# Altium schematic sheet Sheet_1_2026-02-10.schdoc
size 331 x 266 mm
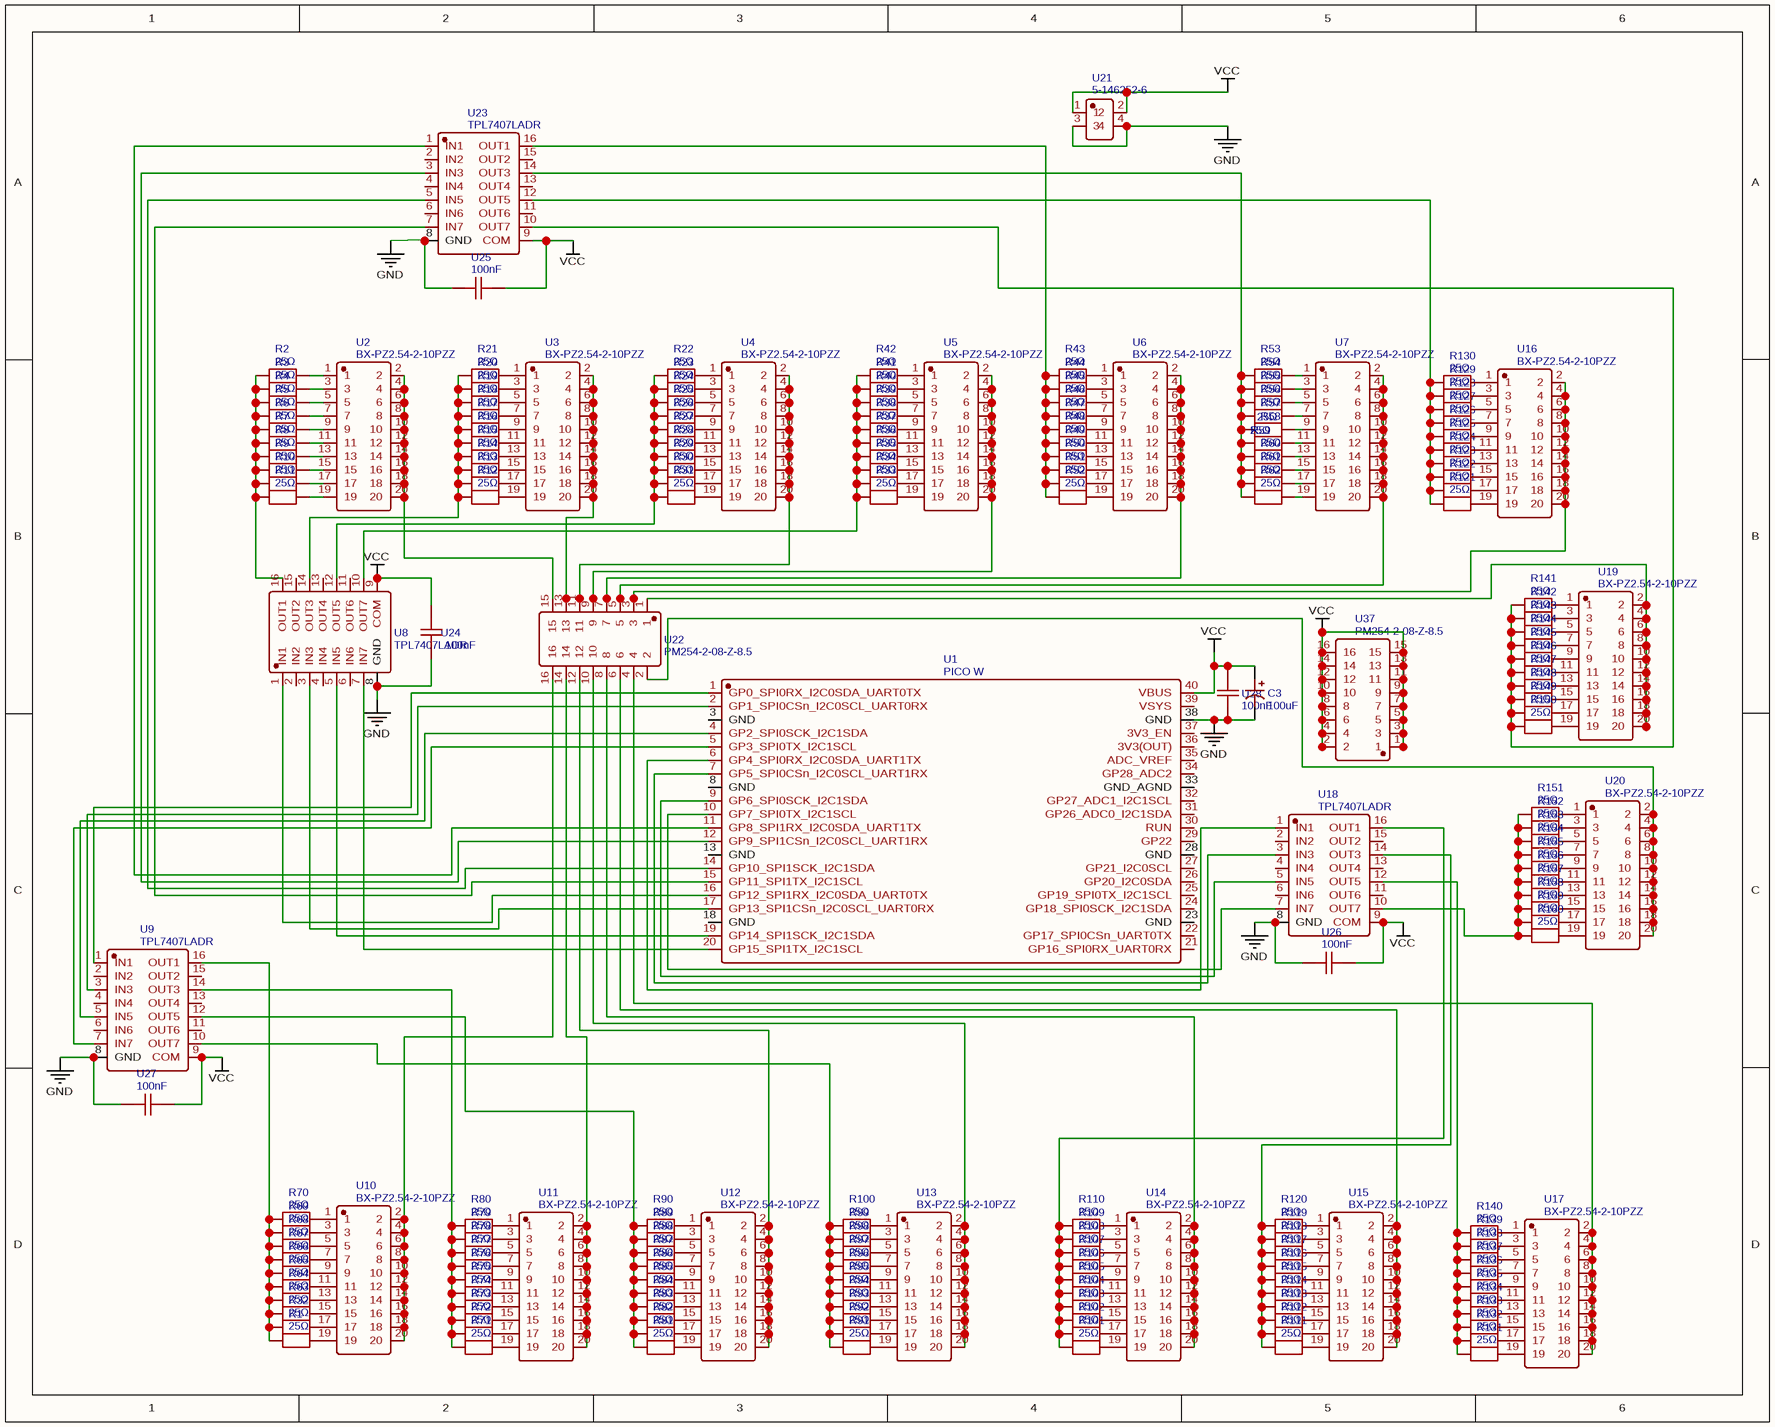
[diagram p0: Sheet_1_2026-02-10.schdoc]

## Parts
C3  100uF  [CAP-TH_BD6.3-P2.50-D0.5-FD-100UF25V6.3X11KM]
R1  25Ω  [R0805]
R2  25Ω  [R0805]
R3  25Ω  [R0805]
R4  25Ω  [R0805]
R5  25Ω  [R0805]
R6  25Ω  [R0805]
R7  25Ω  [R0805]
R8  25Ω  [R0805]
R9  25Ω  [R0805]
R10  25Ω  [R0805]
R11  25Ω  [R0805]
R12  25Ω  [R0805]
R13  25Ω  [R0805]
R14  25Ω  [R0805]
R15  25Ω  [R0805]
R16  25Ω  [R0805]
R17  25Ω  [R0805]
R18  25Ω  [R0805]
R19  25Ω  [R0805]
R20  25Ω  [R0805]
R21  25Ω  [R0805]
R22  25Ω  [R0805]
R23  25Ω  [R0805]
R24  25Ω  [R0805]
R25  25Ω  [R0805]
R26  25Ω  [R0805]
R27  25Ω  [R0805]
R28  25Ω  [R0805]
R29  25Ω  [R0805]
R30  25Ω  [R0805]
R31  25Ω  [R0805]
R32  25Ω  [R0805]
R33  25Ω  [R0805]
R34  25Ω  [R0805]
R35  25Ω  [R0805]
R36  25Ω  [R0805]
R37  25Ω  [R0805]
R38  25Ω  [R0805]
R39  25Ω  [R0805]
R40  25Ω  [R0805]
R41  25Ω  [R0805]
R42  25Ω  [R0805]
R43  25Ω  [R0805]
R44  25Ω  [R0805]
R45  25Ω  [R0805]
R46  25Ω  [R0805]
R47  25Ω  [R0805]
R48  25Ω  [R0805]
R49  25Ω  [R0805]
R50  25Ω  [R0805]
R51  25Ω  [R0805]
R52  25Ω  [R0805]
R53  25Ω  [R0805]
R54  25Ω  [R0805]
R55  25Ω  [R0805]
R56  25Ω  [R0805]
R57  25Ω  [R0805]
R58  25Ω  [R0805]
R59  25Ω  [R0805]
R60  25Ω  [R0805]
R61  25Ω  [R0805]
R62  25Ω  [R0805]
R63  25Ω  [R0805]
R64  25Ω  [R0805]
R65  25Ω  [R0805]
R66  25Ω  [R0805]
R67  25Ω  [R0805]
R68  25Ω  [R0805]
R69  25Ω  [R0805]
R70  25Ω  [R0805]
R71  25Ω  [R0805]
R72  25Ω  [R0805]
R73  25Ω  [R0805]
R74  25Ω  [R0805]
R75  25Ω  [R0805]
R76  25Ω  [R0805]
R77  25Ω  [R0805]
R78  25Ω  [R0805]
R79  25Ω  [R0805]
R80  25Ω  [R0805]
R81  25Ω  [R0805]
R82  25Ω  [R0805]
R83  25Ω  [R0805]
R84  25Ω  [R0805]
R85  25Ω  [R0805]
R86  25Ω  [R0805]
R87  25Ω  [R0805]
R88  25Ω  [R0805]
R89  25Ω  [R0805]
R90  25Ω  [R0805]
R91  25Ω  [R0805]
R92  25Ω  [R0805]
R93  25Ω  [R0805]
R94  25Ω  [R0805]
R95  25Ω  [R0805]
R96  25Ω  [R0805]
R97  25Ω  [R0805]
R98  25Ω  [R0805]
R99  25Ω  [R0805]
R100  25Ω  [R0805]
R101  25Ω  [R0805]
R102  25Ω  [R0805]
R103  25Ω  [R0805]
R104  25Ω  [R0805]
R105  25Ω  [R0805]
R106  25Ω  [R0805]
R107  25Ω  [R0805]
R108  25Ω  [R0805]
R109  25Ω  [R0805]
R110  25Ω  [R0805]
R111  25Ω  [R0805]
R112  25Ω  [R0805]
R113  25Ω  [R0805]
R114  25Ω  [R0805]
R115  25Ω  [R0805]
R116  25Ω  [R0805]
R117  25Ω  [R0805]
R118  25Ω  [R0805]
R119  25Ω  [R0805]
R120  25Ω  [R0805]
R121  25Ω  [R0805]
R122  25Ω  [R0805]
R123  25Ω  [R0805]
R124  25Ω  [R0805]
R125  25Ω  [R0805]
R126  25Ω  [R0805]
R127  25Ω  [R0805]
R128  25Ω  [R0805]
R129  25Ω  [R0805]
R130  25Ω  [R0805]
R131  25Ω  [R0805]
R132  25Ω  [R0805]
R133  25Ω  [R0805]
R134  25Ω  [R0805]
R135  25Ω  [R0805]
R136  25Ω  [R0805]
R137  25Ω  [R0805]
R138  25Ω  [R0805]
R139  25Ω  [R0805]
R140  25Ω  [R0805]
R141  25Ω  [R0805]
R142  25Ω  [R0805]
R143  25Ω  [R0805]
R144  25Ω  [R0805]
R145  25Ω  [R0805]
R146  25Ω  [R0805]
R147  25Ω  [R0805]
R148  25Ω  [R0805]
R149  25Ω  [R0805]
R150  25Ω  [R0805]
R151  25Ω  [R0805]
R152  25Ω  [R0805]
R153  25Ω  [R0805]
R154  25Ω  [R0805]
R155  25Ω  [R0805]
R156  25Ω  [R0805]
R157  25Ω  [R0805]
R158  25Ω  [R0805]
R159  25Ω  [R0805]
R160  25Ω  [R0805]
U1  PICO W  [LCC-40_L51.0-W21.0-P2.54-BL_RP2040-BASED]
U2  BX-PZ2.54-2-10PZZ  [HDR-TH_20P-P2.54-V-M-R2-C10-S2.54]
U3  BX-PZ2.54-2-10PZZ  [HDR-TH_20P-P2.54-V-M-R2-C10-S2.54]
U4  BX-PZ2.54-2-10PZZ  [HDR-TH_20P-P2.54-V-M-R2-C10-S2.54]
U5  BX-PZ2.54-2-10PZZ  [HDR-TH_20P-P2.54-V-M-R2-C10-S2.54]
U6  BX-PZ2.54-2-10PZZ  [HDR-TH_20P-P2.54-V-M-R2-C10-S2.54]
U7  BX-PZ2.54-2-10PZZ  [HDR-TH_20P-P2.54-V-M-R2-C10-S2.54]
U8  TPL7407LADR  [SOIC-16_L9.9-W3.9-P1.27-LS6.0-BL]
U9  TPL7407LADR  [SOIC-16_L9.9-W3.9-P1.27-LS6.0-BL]
U10  BX-PZ2.54-2-10PZZ  [HDR-TH_20P-P2.54-V-M-R2-C10-S2.54]
U11  BX-PZ2.54-2-10PZZ  [HDR-TH_20P-P2.54-V-M-R2-C10-S2.54]
U12  BX-PZ2.54-2-10PZZ  [HDR-TH_20P-P2.54-V-M-R2-C10-S2.54]
U13  BX-PZ2.54-2-10PZZ  [HDR-TH_20P-P2.54-V-M-R2-C10-S2.54]
U14  BX-PZ2.54-2-10PZZ  [HDR-TH_20P-P2.54-V-M-R2-C10-S2.54]
U15  BX-PZ2.54-2-10PZZ  [HDR-TH_20P-P2.54-V-M-R2-C10-S2.54]
U16  BX-PZ2.54-2-10PZZ  [HDR-TH_20P-P2.54-V-M-R2-C10-S2.54]
U17  BX-PZ2.54-2-10PZZ  [HDR-TH_20P-P2.54-V-M-R2-C10-S2.54]
U18  TPL7407LADR  [SOIC-16_L9.9-W3.9-P1.27-LS6.0-BL]
U19  BX-PZ2.54-2-10PZZ  [HDR-TH_20P-P2.54-V-M-R2-C10-S2.54]
U20  BX-PZ2.54-2-10PZZ  [HDR-TH_20P-P2.54-V-M-R2-C10-S2.54]
U21  5-146252-6  [HDR-TH_4P-P2.54-V-M-R2-C2-S2.54]
U22  PM254-2-08-Z-8.5  [HDR-TH_16P-P2.54-V-F-R2-C8-S2.54]
U23  TPL7407LADR  [SOIC-16_L9.9-W3.9-P1.27-LS6.0-BL]
U24  100nF  [C0805]
U25  100nF  [C0805]
U26  100nF  [C0805]
U27  100nF  [C0805]
U28  100nF  [C0805]
U37  PM254-2-08-Z-8.5  [HDR-TH_16P-P2.54-V-F-R2-C8-S2.54]

## Nets
GND: C3.2 U1.38(GND) U8.8(GND) U9.8(GND) U18.8(GND) U21.3 U21.4 U23.8(GND) U24.1 U25.2 U26.2 U27.2 U28.2
VCC: C3.1 U1.40(VBUS) U8.9(COM) U9.9(COM) U18.9(COM) U21.1 U21.2 U23.9(COM) U24.2 U25.1 U26.1 U27.1 U28.1 U37.1 U37.2 U37.3 U37.4 U37.5 U37.6 U37.7 U37.8 U37.9 U37.10 U37.11 U37.12 U37.13 U37.14 U37.15 U37.16
NetR1_1: R1.1 R32.1 R63.1 R64.1 R65.1 R66.1 R67.1 R68.1 R69.1 R70.1 U9.16(OUT1)
NetR1_2: R1.2 U10.19
NetR2_1: R2.1 R3.1 R4.1 R5.1 R6.1 R7.1 R8.1 R9.1 R10.1 R11.1 U8.16(OUT1)
NetR2_2: R2.2 U2.1
NetR3_2: R3.2 U2.3
NetR4_2: R4.2 U2.5
NetR5_2: R5.2 U2.7
NetR6_2: R6.2 U2.9
NetR7_2: R7.2 U2.11
NetR8_2: R8.2 U2.13
NetR9_2: R9.2 U2.15
NetR10_2: R10.2 U2.17
NetR11_2: R11.2 U2.19
NetR12_1: R12.1 R13.1 R14.1 R15.1 R16.1 R17.1 R18.1 R19.1 R20.1 R21.1 U8.14(OUT3)
NetR12_2: R12.2 U3.19
NetR13_2: R13.2 U3.17
NetR14_2: R14.2 U3.15
NetR15_2: R15.2 U3.13
NetR16_2: R16.2 U3.11
NetR17_2: R17.2 U3.9
NetR18_2: R18.2 U3.7
NetR19_2: R19.2 U3.5
NetR20_2: R20.2 U3.3
NetR21_2: R21.2 U3.1
NetR22_1: R22.1 R23.1 R24.1 R25.1 R26.1 R27.1 R28.1 R29.1 R30.1 R31.1 U8.12(OUT5)
NetR22_2: R22.2 U4.1
NetR23_2: R23.2 U4.3
NetR24_2: R24.2 U4.5
NetR25_2: R25.2 U4.7
NetR26_2: R26.2 U4.9
NetR27_2: R27.2 U4.11
NetR28_2: R28.2 U4.13
NetR29_2: R29.2 U4.15
NetR30_2: R30.2 U4.17
NetR31_2: R31.2 U4.19
NetR32_2: R32.2 U10.17
NetR33_1: R33.1 R34.1 R35.1 R36.1 R37.1 R38.1 R39.1 R40.1 R41.1 R42.1 U8.10(OUT7)
NetR33_2: R33.2 U5.19
NetR34_2: R34.2 U5.17
NetR35_2: R35.2 U5.15
NetR36_2: R36.2 U5.13
NetR37_2: R37.2 U5.11
NetR38_2: R38.2 U5.9
NetR39_2: R39.2 U5.7
NetR40_2: R40.2 U5.5
NetR41_2: R41.2 U5.3
NetR42_2: R42.2 U5.1
NetR43_1: R43.1 R44.1 R45.1 R46.1 R47.1 R48.1 R49.1 R50.1 R51.1 R52.1 U23.16(OUT1)
NetR43_2: R43.2 U6.1
NetR44_2: R44.2 U6.3
NetR45_2: R45.2 U6.5
NetR46_2: R46.2 U6.7
NetR47_2: R47.2 U6.9
NetR48_2: R48.2 U6.11
NetR49_2: R49.2 U6.13
NetR50_2: R50.2 U6.15
NetR51_2: R51.2 U6.17
NetR52_2: R52.2 U6.19
NetR53_1: R53.1 R54.1 R55.1 R56.1 R57.1 R58.1 R59.1 R60.1 R61.1 R62.1 U23.14(OUT3)
NetR53_2: R53.2 U7.1
NetR54_2: R54.2 U7.3
NetR55_2: R55.2 U7.5
NetR56_2: R56.2 U7.7
NetR57_2: R57.2 U7.9
NetR58_2: R58.2 U7.11
NetR59_2: R59.2 U7.13
NetR60_2: R60.2 U7.15
NetR61_2: R61.2 U7.17
NetR62_2: R62.2 U7.19
NetR63_2: R63.2 U10.15
NetR64_2: R64.2 U10.13
NetR65_2: R65.2 U10.11
NetR66_2: R66.2 U10.9
NetR67_2: R67.2 U10.7
NetR68_2: R68.2 U10.5
NetR69_2: R69.2 U10.3
NetR70_2: R70.2 U10.1
NetR71_1: R71.1 R72.1 R73.1 R74.1 R75.1 R76.1 R77.1 R78.1 R79.1 R80.1 U9.14(OUT3)
NetR71_2: R71.2 U11.19
NetR72_2: R72.2 U11.17
NetR73_2: R73.2 U11.15
NetR74_2: R74.2 U11.13
NetR75_2: R75.2 U11.11
NetR76_2: R76.2 U11.9
NetR77_2: R77.2 U11.7
NetR78_2: R78.2 U11.5
NetR79_2: R79.2 U11.3
NetR80_2: R80.2 U11.1
NetR81_1: R81.1 R82.1 R83.1 R84.1 R85.1 R86.1 R87.1 R88.1 R89.1 R90.1 U9.12(OUT5)
NetR81_2: R81.2 U12.19
NetR82_2: R82.2 U12.17
NetR83_2: R83.2 U12.15
NetR84_2: R84.2 U12.13
NetR85_2: R85.2 U12.11
NetR86_2: R86.2 U12.9
NetR87_2: R87.2 U12.7
NetR88_2: R88.2 U12.5
NetR89_2: R89.2 U12.3
NetR90_2: R90.2 U12.1
NetR91_1: R91.1 R92.1 R93.1 R94.1 R95.1 R96.1 R97.1 R98.1 R99.1 R100.1 U9.10(OUT7)
NetR91_2: R91.2 U13.19
NetR92_2: R92.2 U13.17
NetR93_2: R93.2 U13.15
NetR94_2: R94.2 U13.13
NetR95_2: R95.2 U13.11
NetR96_2: R96.2 U13.9
NetR97_2: R97.2 U13.7
NetR98_2: R98.2 U13.5
NetR99_2: R99.2 U13.3
NetR100_2: R100.2 U13.1
NetR101_1: R101.1 R102.1 R103.1 R104.1 R105.1 R106.1 R107.1 R108.1 R109.1 R110.1 U18.16(OUT1)
NetR101_2: R101.2 U14.19
NetR102_2: R102.2 U14.17
NetR103_2: R103.2 U14.15
NetR104_2: R104.2 U14.13
NetR105_2: R105.2 U14.11
NetR106_2: R106.2 U14.9
NetR107_2: R107.2 U14.7
NetR108_2: R108.2 U14.5
NetR109_2: R109.2 U14.3
NetR110_2: R110.2 U14.1
NetR111_1: R111.1 R112.1 R113.1 R114.1 R115.1 R116.1 R117.1 R118.1 R119.1 R120.1 U18.14(OUT3)
NetR111_2: R111.2 U15.19
NetR112_2: R112.2 U15.17
NetR113_2: R113.2 U15.15
NetR114_2: R114.2 U15.13
NetR115_2: R115.2 U15.11
NetR116_2: R116.2 U15.9
NetR117_2: R117.2 U15.7
NetR118_2: R118.2 U15.5
NetR119_2: R119.2 U15.3
NetR120_2: R120.2 U15.1
NetR121_1: R121.1 R122.1 R123.1 R124.1 R125.1 R126.1 R127.1 R128.1 R129.1 R130.1 U23.12(OUT5)
NetR121_2: R121.2 U16.19
NetR122_2: R122.2 U16.17
NetR123_2: R123.2 U16.15
NetR124_2: R124.2 U16.13
NetR125_2: R125.2 U16.11
NetR126_2: R126.2 U16.9
NetR127_2: R127.2 U16.7
NetR128_2: R128.2 U16.5
NetR129_2: R129.2 U16.3
NetR130_2: R130.2 U16.1
NetR131_1: R131.1 R132.1 R133.1 R134.1 R135.1 R136.1 R137.1 R138.1 R139.1 R140.1 U18.12(OUT5)
NetR131_2: R131.2 U17.19
NetR132_2: R132.2 U17.17
NetR133_2: R133.2 U17.15
NetR134_2: R134.2 U17.13
NetR135_2: R135.2 U17.11
NetR136_2: R136.2 U17.9
NetR137_2: R137.2 U17.7
NetR138_2: R138.2 U17.5
NetR139_2: R139.2 U17.3
NetR140_2: R140.2 U17.1
NetR141_1: R141.1 R142.1 R143.1 R144.1 R145.1 R146.1 R147.1 R148.1 R149.1 R150.1 U23.10(OUT7)
NetR141_2: R141.2 U19.1
NetR142_2: R142.2 U19.3
NetR143_2: R143.2 U19.5
NetR144_2: R144.2 U19.7
NetR145_2: R145.2 U19.9
NetR146_2: R146.2 U19.11
NetR147_2: R147.2 U19.13
NetR148_2: R148.2 U19.15
NetR149_2: R149.2 U19.17
NetR150_2: R150.2 U19.19
NetR151_1: R151.1 R152.1 R153.1 R154.1 R155.1 R156.1 R157.1 R158.1 R159.1 R160.1 U18.10(OUT7)
NetR151_2: R151.2 U20.1
NetR152_2: R152.2 U20.3
NetR153_2: R153.2 U20.5
NetR154_2: R154.2 U20.7
NetR155_2: R155.2 U20.9
NetR156_2: R156.2 U20.11
NetR157_2: R157.2 U20.13
NetR158_2: R158.2 U20.15
NetR159_2: R159.2 U20.17
NetR160_2: R160.2 U20.19
NetU1_1: U1.1(GP0_SPI0RX_I2C0SDA_UART0TX) U9.1(IN1)
NetU1_2: U1.2(GP1_SPI0CSn_I2C0SCL_UART0RX) U9.3(IN3)
NetU1_4: U1.4(GP2_SPI0SCK_I2C1SDA) U9.5(IN5)
NetU1_5: U1.5(GP3_SPI0TX_I2C1SCL) U9.7(IN7)
NetU1_6: U1.6(GP4_SPI0RX_I2C0SDA_UART1TX) U18.1(IN1)
NetU1_7: U1.7(GP5_SPI0CSn_I2C0SCL_UART1RX) U18.3(IN3)
NetU1_9: U1.9(GP6_SPI0SCK_I2C1SDA) U18.5(IN5)
NetU1_10: U1.10(GP7_SPI0TX_I2C1SCL) U18.7(IN7)
NetU1_11: U1.11(GP8_SPI1RX_I2C0SDA_UART1TX) U23.1(IN1)
NetU1_12: U1.12(GP9_SPI1CSn_I2C0SCL_UART1RX) U23.3(IN3)
NetU1_14: U1.14(GP10_SPI1SCK_I2C1SDA) U23.5(IN5)
NetU1_15: U1.15(GP11_SPI1TX_I2C1SCL) U23.7(IN7)
NetU1_16: U1.16(GP12_SPI1RX_I2C0SDA_UART0TX) U8.1(IN1)
NetU1_17: U1.17(GP13_SPI1CSn_I2C0SCL_UART0RX) U8.3(IN3)
NetU1_19: U1.19(GP14_SPI1SCK_I2C1SDA) U8.5(IN5)
NetU1_20: U1.20(GP15_SPI1TX_I2C1SCL) U8.7(IN7)
NetU2_2: U2.2 U2.4 U2.6 U2.8 U2.10 U2.12 U2.14 U2.16 U2.18 U2.20 U22.15
NetU3_2: U3.2 U3.4 U3.6 U3.8 U3.10 U3.12 U3.14 U3.16 U3.18 U3.20 U22.13
NetU4_2: U4.2 U4.4 U4.6 U4.8 U4.10 U4.12 U4.14 U4.16 U4.18 U4.20 U22.11
NetU5_2: U5.2 U5.4 U5.6 U5.8 U5.10 U5.12 U5.14 U5.16 U5.18 U5.20 U22.9
NetU6_2: U6.2 U6.4 U6.6 U6.8 U6.10 U6.12 U6.14 U6.16 U6.18 U6.20 U22.7
NetU7_2: U7.2 U7.4 U7.6 U7.8 U7.10 U7.12 U7.14 U7.16 U7.18 U7.20 U22.5
NetU10_2: U10.2 U10.4 U10.6 U10.8 U10.10 U10.12 U10.14 U10.16 U10.18 U10.20 U22.16
NetU11_2: U11.2 U11.4 U11.6 U11.8 U11.10 U11.12 U11.14 U11.16 U11.18 U11.20 U22.14
NetU12_2: U12.2 U12.4 U12.6 U12.8 U12.10 U12.12 U12.14 U12.16 U12.18 U12.20 U22.12
NetU13_2: U13.2 U13.4 U13.6 U13.8 U13.10 U13.12 U13.14 U13.16 U13.18 U13.20 U22.10
NetU14_2: U14.2 U14.4 U14.6 U14.8 U14.10 U14.12 U14.14 U14.16 U14.18 U14.20 U22.8
NetU15_2: U15.2 U15.4 U15.6 U15.8 U15.10 U15.12 U15.14 U15.16 U15.18 U15.20 U22.6
NetU16_2: U16.2 U16.4 U16.6 U16.8 U16.10 U16.12 U16.14 U16.16 U16.18 U16.20 U22.3
NetU17_2: U17.2 U17.4 U17.6 U17.8 U17.10 U17.12 U17.14 U17.16 U17.18 U17.20 U22.4
NetU19_2: U19.2 U19.4 U19.6 U19.8 U19.10 U19.12 U19.14 U19.16 U19.18 U19.20 U22.1
NetU20_2: U20.2 U20.4 U20.6 U20.8 U20.10 U20.12 U20.14 U20.16 U20.18 U20.20 U22.2

Not connected (* = marked no-connect by the designer): U1 3(GND) 8(GND) 13(GND) 18(GND) 21(GP16_SPI0RX_UART0RX) 22(GP17_SPI0CSn_UART0TX) 23(GND) 24(GP18_SPI0SCK_I2C1SDA) 25(GP19_SPI0TX_I2C1SCL) 26(GP20_I2C0SDA) 27(GP21_I2C0SCL) 28(GND) 29(GP22) 30(RUN) 31(GP26_ADC0_I2C1SDA) 32(GP27_ADC1_I2C1SCL) 33(GND_AGND) 34(GP28_ADC2) 35(ADC_VREF) 36(3V3(OUT)) 37(3V3_EN) 39(VSYS); U8 2(IN2) 4(IN4) 6(IN6) 11(OUT6) 13(OUT4) 15(OUT2); U9 2(IN2) 4(IN4) 6(IN6) 11(OUT6) 13(OUT4) 15(OUT2); U18 2(IN2) 4(IN4) 6(IN6) 11(OUT6) 13(OUT4) 15(OUT2); U23 2(IN2) 4(IN4) 6(IN6) 11(OUT6) 13(OUT4) 15(OUT2)

## Library data of the parts
C3 = 100uF: Manufacturer: Econd(米朗电子); Manufacturer Part: 100uF25V6.3x11KM; nameAlias: Value; Contributor: lcsc; Supplier: LCSC; Supplier Part: C49304911; JLCPCB Part Class: Extended Part; spicePre: C; spiceSymbolName: 100UF25V6.3X11KM
R1-R160 = 25Ω: Manufacturer: YAGEO(国巨); Manufacturer Part: RT0805BRD0725RL; nameAlias: Value; Contributor: lcsc; Supplier: LCSC; Supplier Part: C6288413; JLCPCB Part Class: Extended Part; spicePre: R; spiceSymbolName: RT0805BRD0725RL
U1 = PICO W: Manufacturer: Raspberry Pi(树莓派); Contributor: lcsc; Supplier: LCSC; Supplier Part: C7203003; Manufacturer Part: PICO W; JLCPCB Part Class: Extended Part; spicePre: U; spiceSymbolName: PICO W
U2-U7 U10-U17 U19 U20 = BX-PZ2.54-2-10PZZ: Manufacturer: Bossie(博锡); Contributor: lcsc; Supplier: LCSC; Supplier Part: C18078218; Manufacturer Part: BX-PZ2.54-2-10PZZ; JLCPCB Part Class: Extended Part; spicePre: U; spiceSymbolName: BX-PZ2.54-2-10PZZ
U8 U9 U18 U23 = TPL7407LADR: Manufacturer: TI(德州仪器); Contributor: LCSC; Supplier: LCSC; Supplier Part: C2149826; Manufacturer Part: TPL7407LADR; JLCPCB Part Class: Extended Part; spicePre: U; spiceSymbolName: TPL7407LADR
U21 = 5-146252-6: Manufacturer: TE Connectivity(泰科电子); Contributor: lcsc; Supplier: LCSC; Supplier Part: C3332042; Manufacturer Part: 5-146252-6; JLCPCB Part Class: Extended Part; spicePre: U; spiceSymbolName: 5-146252-6
U22 U37 = PM254-2-08-Z-8.5: Manufacturer: HCTL(华灿天禄); Contributor: LCSC; Supplier: LCSC; Supplier Part: C2897409; Manufacturer Part: PM254-2-08-Z-8.5; JLCPCB Part Class: Extended Part; spicePre: U; spiceSymbolName: PM254-2-08-Z-8.5
U24-U28 = 100nF: Manufacturer: YAGEO(国巨); Manufacturer Part: CC0805KKX7RYBB104; Contributor: lcsc; nameAlias: Value; Supplier: LCSC; Supplier Part: C5182461; JLCPCB Part Class: Extended Part; spicePre: U; spiceSymbolName: CC0805KKX7RYBB104